# Altium schematic sheet HarmonicControl.SchDoc
size A
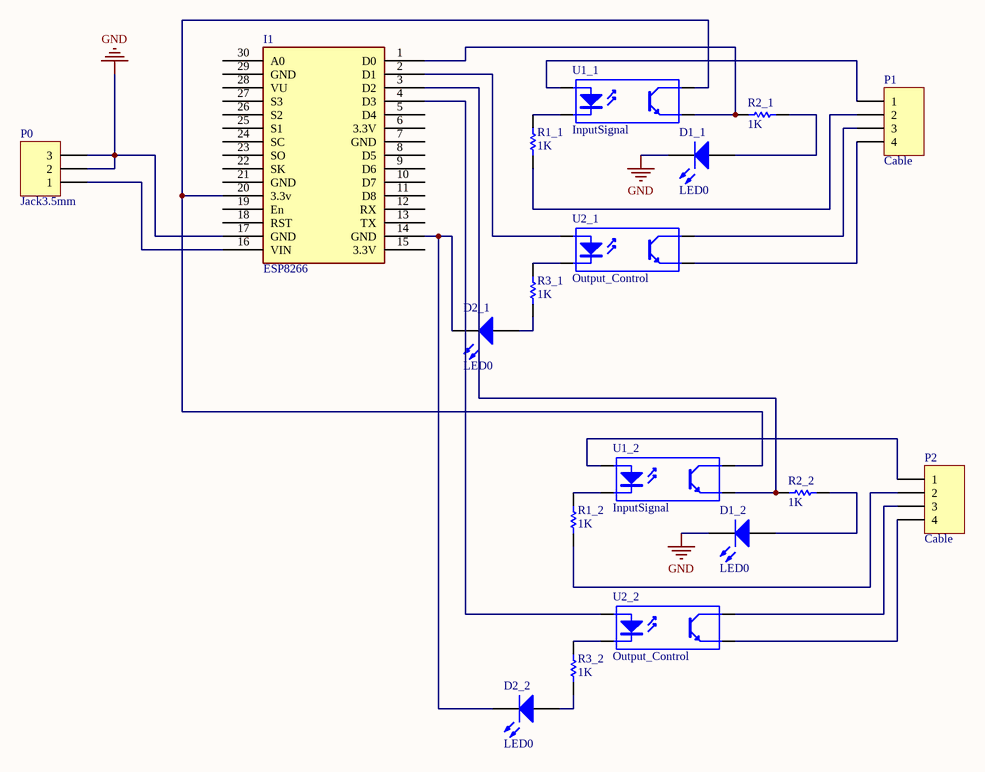
[diagram p0: HarmonicControl.SchDoc]

## Parts
D1_1  LED0  [LED-0]
D1_2  LED0  [LED-0]
D2_1  LED0  [LED-0]
D2_2  LED0  [LED-0]
I1  ESP8266  [ESP8266_Node_MCU_V3]
P0  Jack3.5mm  [HDR1X3]
P1  Cable  [HDR1X4]
P2  Cable  [HDR1X4]
R1_1  value 1K  [AXIAL-0.3]  (hidden comment: Res1)
R1_2  value 1K  [AXIAL-0.3]  (hidden comment: Res1)
R2_1  value 1K  [AXIAL-0.3]  (hidden comment: Res1)
R2_2  value 1K  [AXIAL-0.3]  (hidden comment: Res1)
R3_1  value 1K  [AXIAL-0.3]  (hidden comment: Res1)
R3_2  value 1K  [AXIAL-0.3]  (hidden comment: Res1)
U1_1  InputSignal  [DIP-4]
U1_2  InputSignal  [DIP-4]
U2_1  Output_Control  [DIP-4]
U2_2  Output_Control  [DIP-4]

## Nets
GND: D1_1.2(K) D1_2.2(K) I1.17(GND) P0.2 P0.3
NetD1_1_1: D1_1.1(A) R2_1.2
NetD1_2_1: D1_2.1(A) R2_2.2
NetD2_1_1: D2_1.1(A) R3_1.1
NetD2_1_2: D2_1.2(K) D2_2.2(K) I1.14(GND)
NetD2_2_1: D2_2.1(A) R3_2.1
NetI1_1: I1.1(D0) R2_1.1 U1_1.3(E)
NetI1_2: I1.2(D1) U2_1.1(A)
NetI1_3: I1.3(D2) R2_2.1 U1_2.3(E)
NetI1_4: I1.4(D3) U2_2.1(A)
NetI1_16: I1.16(VIN) P0.1
NetI1_20: I1.20(3.3v) U1_1.4(C) U1_2.4(C)
NetP1_1: P1.1 U1_1.1(A)
NetP1_2: P1.2 R1_1.1
NetP1_3: P1.3 U2_1.4(C)
NetP1_4: P1.4 U2_1.3(E)
NetP2_1: P2.1 U1_2.1(A)
NetP2_2: P2.2 R1_2.1
NetP2_3: P2.3 U2_2.4(C)
NetP2_4: P2.4 U2_2.3(E)
NetR1_1_2: R1_1.2 U1_1.2(K)
NetR1_2_2: R1_2.2 U1_2.2(K)
NetR3_1_2: R3_1.2 U2_1.2(K)
NetR3_2_2: R3_2.2 U2_2.2(K)

Not connected (* = marked no-connect by the designer): I1 5(D4) 6(3.3V) 7(GND) 8(D5) 9(D6) 10(D7) 11(D8) 12(RX) 13(TX) 15(3.3V) 18(RST) 19(En) 21(GND) 22(SK) 23(SO) 24(SC) 25(S1) 26(S2) 27(S3) 28(VU) 29(GND) 30(A0)

## Library data of the parts
D1_1 D1_2 D2_1 D2_2 = LED0: Typical INFRARED GaAs LED; Published: 8-Jun-2000; LatestRevisionDate: 08-Jul-2005; LatestRevisionNote: Mech Layer 1 removed.; PackageReference: LED-0; Publisher: Altium Limited; PackageDescription: LED; 2 Leads
I1 = ESP8266_Node_MCU_V3
P0 = Header 3: Header, 3-Pin; LatestRevisionDate: 17-Jul-2002; LatestRevisionNote: Re-released for DXP Platform.; Publisher: Altium Limited
P1 P2 = Header 4: Header, 4-Pin; LatestRevisionDate: 17-Jul-2002; LatestRevisionNote: Re-released for DXP Platform.; Publisher: Altium Limited
R1_1 R1_2 R2_1 R2_2 R3_1 R3_2 = Res1: Resistor; Published: 8-Jun-2000; LatestRevisionDate: 17-Jul-2002; LatestRevisionNote: Re-released for DXP Platform.; PackageReference: AXIAL-0.3; Publisher: Altium Limited; PackageDescription: Axial Device, Thru-Hole; 2 Leads; 0.3 in Pin Spacing
U1_1 U1_2 U2_1 U2_2 = Optoisolator1: 4-Pin Phototransistor Optocoupler; Published: 24-Mar-1999; LatestRevisionDate: 04-Mar-2005; LatestRevisionNote: Sch pins 3 & 4 Swapped.; DatasheetVersion: Nov-2003; PackageReference: DIP-4; Publisher: Altium Limited